# Altium schematic sheet AltiumDabaseLib.SchDoc
size A4; SheetNumber: 1; SheetTotal: 1
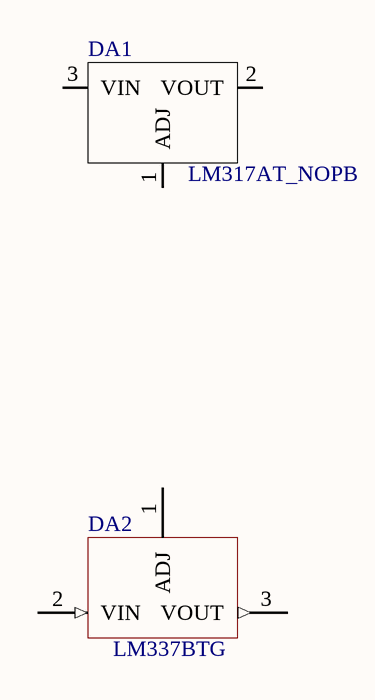
[diagram p0: AltiumDabaseLib.SchDoc]

## Parts
DA1  LM317AT_NOPB  [TO254P470X1028X1955-3P]
DA2  LM337BTG  [TO254P482X997X2018-3P]

## Nets

Not connected (* = marked no-connect by the designer): DA1 1(ADJ) 2(VOUT) 3(VIN); DA2 1(ADJ) 2(VIN) 3(VOUT)

## Library data of the parts
DA1 = LM317AT_NOPB: Integrated Circuit; Manufacturer_Name: Texas Instruments; Manufacturer_Part_Number: LM317AT/NOPB; Datasheet Link: http://www.ti.com/lit/gpn/lm317a; Height: 4.7mm; Mouser Part Number: 926-LM317AT/NOPB; Mouser Price/Stock: https://www.mouser.co.uk/ProductDetail/Texas-Instruments/LM317AT-NOPB?qs=X1J7HmVL2ZFYFJRcNgsWcQ%3D%3D; Arrow Part Number: LM317AT/NOPB; Arrow Price/Stock: https://www.arrow.com/en/products/lm317atnopb/texas-instruments; Part Number: LM317AT_NOPB
DA2 = LM337BTG: Integrated Circuit; Manufacturer_Name: ON Semiconductor; Datasheet Link: http://www.onsemi.com/pub/Collateral/LM337-D.PDF; Height: 4.82mm; Manufacturer_Part_Number: LM337BTG; Mouser Part Number: 863-LM337BTG; Mouser Price/Stock: https://www.mouser.co.uk/ProductDetail/ON-Semiconductor/LM337BTG?qs=2OtswVQKCOGoOfwNKxF%2F1w%3D%3D; Arrow Part Number: LM337BTG; Arrow Price/Stock: https://www.arrow.com/en/products/lm337btg/on-semiconductor; Part Number: LM337BTG